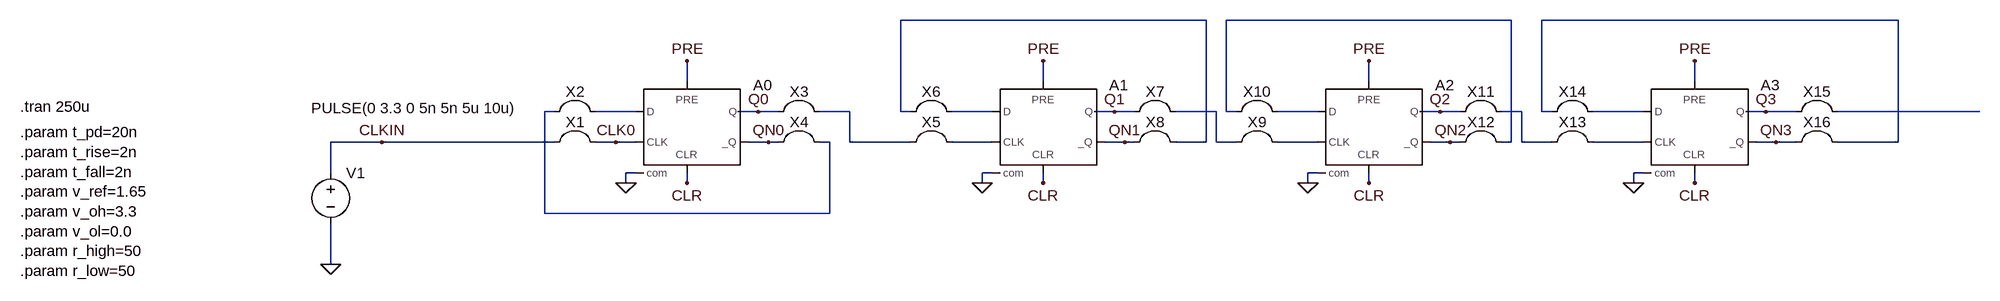
[diagram p0: schematic flip_flop_experimenter.asc]
flip_flop_experimenter.asc, the LTspice schematic file:
Version 4
SHEET 1 3364 680
WIRE 2144 -368 1664 -368
WIRE 2624 -368 2176 -368
WIRE 3232 -368 2672 -368
WIRE 1328 -272 1328 -304
WIRE 1888 -272 1888 -304
WIRE 2400 -272 2400 -304
WIRE 2912 -272 2912 -304
WIRE 1120 -224 1104 -224
WIRE 1248 -224 1184 -224
WIRE 1440 -224 1408 -224
WIRE 1472 -224 1440 -224
WIRE 1584 -224 1536 -224
WIRE 1664 -224 1664 -368
WIRE 1680 -224 1664 -224
WIRE 1808 -224 1744 -224
WIRE 2000 -224 1968 -224
WIRE 2032 -224 2000 -224
WIRE 2160 -224 2096 -224
WIRE 2176 -224 2176 -368
WIRE 2192 -224 2176 -224
WIRE 2320 -224 2256 -224
WIRE 2512 -224 2480 -224
WIRE 2544 -224 2512 -224
WIRE 2640 -224 2608 -224
WIRE 2672 -224 2672 -368
WIRE 2688 -224 2672 -224
WIRE 2832 -224 2752 -224
WIRE 3024 -224 2992 -224
WIRE 3072 -224 3024 -224
WIRE 3360 -224 3136 -224
WIRE 848 -176 768 -176
WIRE 1120 -176 848 -176
WIRE 1216 -176 1184 -176
WIRE 1248 -176 1216 -176
WIRE 1456 -176 1424 -176
WIRE 1472 -176 1456 -176
WIRE 1552 -176 1536 -176
WIRE 1584 -176 1584 -224
WIRE 1680 -176 1584 -176
WIRE 1808 -176 1744 -176
WIRE 2016 -176 1984 -176
WIRE 2032 -176 2016 -176
WIRE 2144 -176 2144 -368
WIRE 2144 -176 2096 -176
WIRE 2160 -176 2160 -224
WIRE 2192 -176 2160 -176
WIRE 2320 -176 2256 -176
WIRE 2528 -176 2496 -176
WIRE 2544 -176 2528 -176
WIRE 2624 -176 2624 -368
WIRE 2624 -176 2608 -176
WIRE 2640 -176 2640 -224
WIRE 2688 -176 2640 -176
WIRE 2832 -176 2752 -176
WIRE 3040 -176 3008 -176
WIRE 3072 -176 3040 -176
WIRE 3232 -176 3232 -368
WIRE 3232 -176 3136 -176
WIRE 768 -128 768 -176
WIRE 1248 -128 1232 -128
WIRE 1808 -128 1792 -128
WIRE 2320 -128 2304 -128
WIRE 2832 -128 2816 -128
WIRE 1232 -112 1232 -128
WIRE 1328 -112 1328 -128
WIRE 1792 -112 1792 -128
WIRE 1888 -112 1888 -128
WIRE 2304 -112 2304 -128
WIRE 2400 -112 2400 -128
WIRE 2816 -112 2816 -128
WIRE 2912 -112 2912 -128
WIRE 1104 -64 1104 -224
WIRE 1552 -64 1552 -176
WIRE 1552 -64 1104 -64
WIRE 768 16 768 -48
FLAG 1232 -112 0
FLAG 768 16 0
FLAG 848 -176 CLKIN
FLAG 1216 -176 CLK0
FLAG 1440 -224 Q0
FLAG 1328 -112 CLR
FLAG 1328 -304 PRE
FLAG 1792 -112 0
FLAG 2000 -224 Q1
FLAG 1888 -112 CLR
FLAG 1888 -304 PRE
FLAG 2304 -112 0
FLAG 2512 -224 Q2
FLAG 2400 -112 CLR
FLAG 2400 -304 PRE
FLAG 2816 -112 0
FLAG 3024 -224 Q3
FLAG 2912 -112 CLR
FLAG 2912 -304 PRE
FLAG 1456 -176 QN0
FLAG 2016 -176 QN1
FLAG 2528 -176 QN2
FLAG 3040 -176 QN3
SYMBOL Digital\\dflop 1328 -272 R0
SYMATTR InstName A0
SYMATTR SpiceLine Vhigh {v_oh} Vlow {v_ol} Trise {t_rise} Tfall {t_fall} TD {t_pd} REF {v_ref}
SYMATTR SpiceLine2 rhigh {r_high} rlow {r_low}
SYMBOL voltage 768 -144 R0
WINDOW 123 0 0 Left 0
WINDOW 39 0 0 Left 0
WINDOW 3 -31 -86 Left 2
SYMATTR InstName V1
SYMATTR Value PULSE(0 3.3 0 5n 5n 5u 10u)
SYMBOL Digital\\dflop 1888 -272 R0
SYMATTR InstName A1
SYMATTR SpiceLine Vhigh {v_oh} Vlow {v_ol} Trise {t_rise} Tfall {t_fall} TD {t_pd} REF {v_ref}
SYMATTR SpiceLine2 rhigh {r_high} rlow {r_low}
SYMBOL Digital\\dflop 2400 -272 R0
SYMATTR InstName A2
SYMATTR SpiceLine Vhigh {v_oh} Vlow {v_ol} Trise {t_rise} Tfall {t_fall} TD {t_pd} REF {v_ref}
SYMATTR SpiceLine2 rhigh {r_high} rlow {r_low}
SYMBOL Digital\\dflop 2912 -272 R0
SYMATTR InstName A3
SYMATTR SpiceLine Vhigh {v_oh} Vlow {v_ol} Trise {t_rise} Tfall {t_fall} TD {t_pd} REF {v_ref}
SYMATTR SpiceLine2 rhigh {r_high} rlow {r_low}
SYMBOL Misc\\jumper 1152 -240 R0
SYMATTR InstName X1
SYMBOL Misc\\jumper 1152 -288 R0
SYMATTR InstName X2
SYMBOL Misc\\jumper 1504 -288 R0
SYMATTR InstName X3
SYMBOL Misc\\jumper 1504 -240 R0
SYMATTR InstName X4
SYMBOL Misc\\jumper 1712 -240 R0
SYMATTR InstName X5
SYMBOL Misc\\jumper 1712 -288 R0
SYMATTR InstName X6
SYMBOL Misc\\jumper 2064 -288 R0
SYMATTR InstName X7
SYMBOL Misc\\jumper 2064 -240 R0
SYMATTR InstName X8
SYMBOL Misc\\jumper 2224 -240 R0
SYMATTR InstName X9
SYMBOL Misc\\jumper 2224 -288 R0
SYMATTR InstName X10
SYMBOL Misc\\jumper 2576 -288 R0
SYMATTR InstName X11
SYMBOL Misc\\jumper 2576 -240 R0
SYMATTR InstName X12
SYMBOL Misc\\jumper 2720 -240 R0
SYMATTR InstName X13
SYMBOL Misc\\jumper 2720 -288 R0
SYMATTR InstName X14
SYMBOL Misc\\jumper 3104 -288 R0
SYMATTR InstName X15
SYMBOL Misc\\jumper 3104 -240 R0
SYMATTR InstName X16
TEXT 280 -232 Left 2 !.tran 250u
TEXT 280 -192 Left 2 !.param t_pd=20n\n.param t_rise=2n\n.param t_fall=2n\n.param v_ref=1.65\n.param v_oh=3.3\n.param v_ol=0.0\n.param r_high=50\n.param r_low=50

The netlist it stands for:
* flip_flop_experimenter.asc
A0 QN0 0 CLK0 PRE CLR QN0 Q0 0 DFLOP Vhigh {v_oh} Vlow {v_ol} Trise {t_rise} Tfall {t_fall} TD {t_pd} REF {v_ref} rhigh {r_high} rlow {r_low}
V1 CLK0 0 PULSE(0 3.3 0 5n 5n 5u 10u)
A1 QN1 0 Q0 PRE CLR QN1 Q1 0 DFLOP Vhigh {v_oh} Vlow {v_ol} Trise {t_rise} Tfall {t_fall} TD {t_pd} REF {v_ref} rhigh {r_high} rlow {r_low}
A2 QN2 0 Q1 PRE CLR QN2 Q2 0 DFLOP Vhigh {v_oh} Vlow {v_ol} Trise {t_rise} Tfall {t_fall} TD {t_pd} REF {v_ref} rhigh {r_high} rlow {r_low}
A3 QN3 0 Q2 PRE CLR QN3 Q3 0 DFLOP Vhigh {v_oh} Vlow {v_ol} Trise {t_rise} Tfall {t_fall} TD {t_pd} REF {v_ref} rhigh {r_high} rlow {r_low}
.tran 250u
.param t_pd=20n
.param t_rise=2n
.param t_fall=2n
.param v_ref=1.65
.param v_oh=3.3
.param v_ol=0.0
.param r_high=50
.param r_low=50
.backanno
.end